# Altium schematic sheet Servo Controller Board.SchDoc
size A3; SheetNumber: 1; SheetTotal: 1
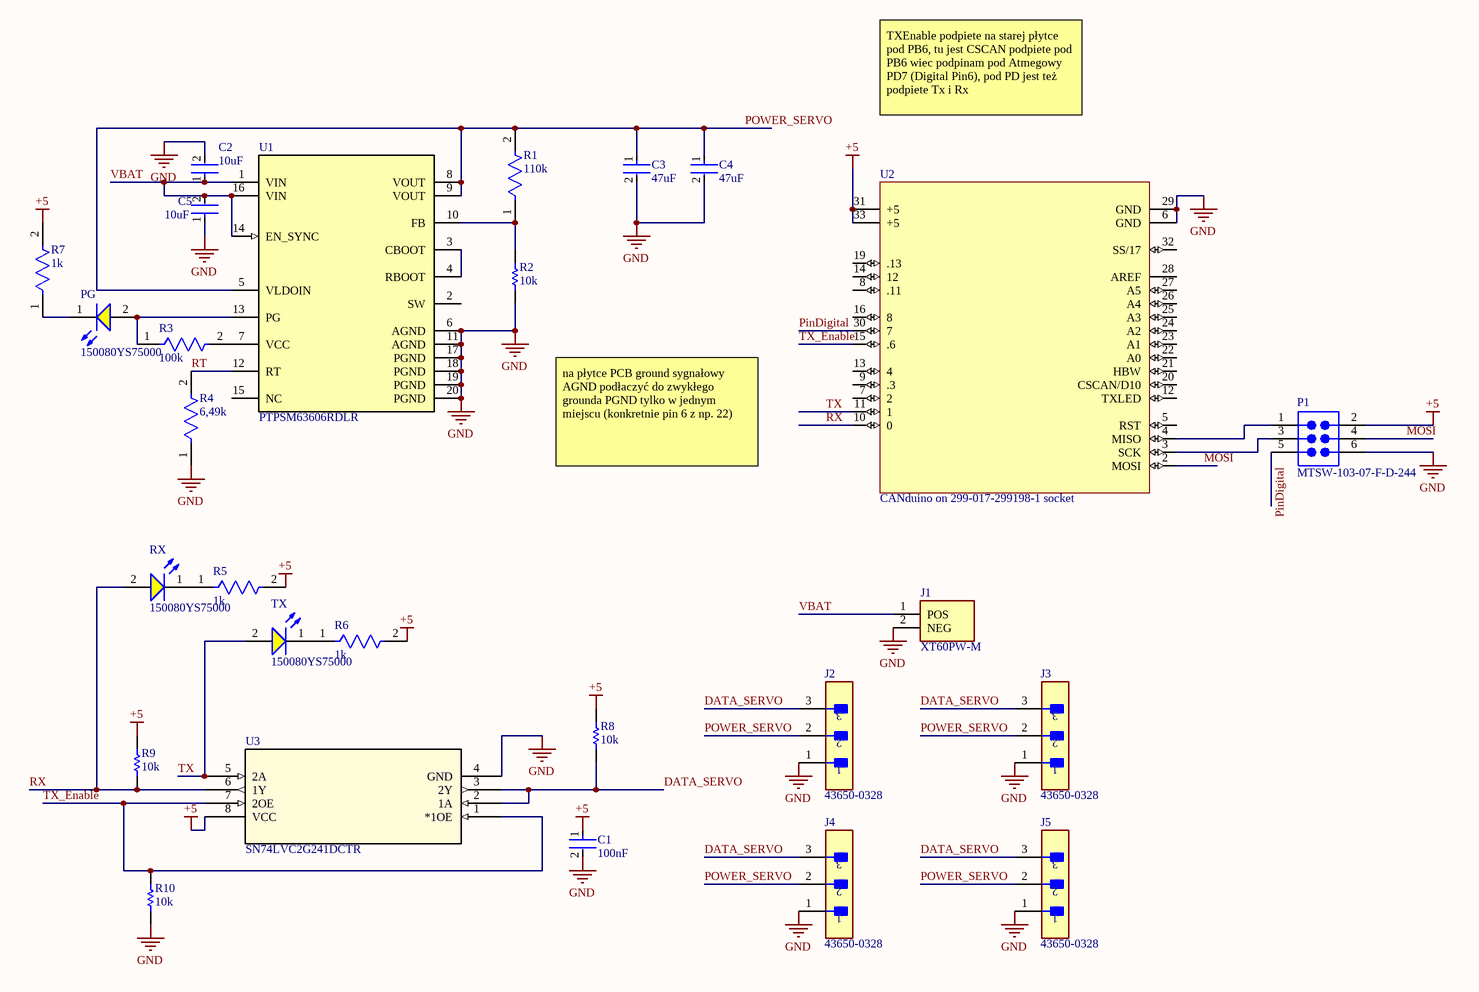
[diagram p0: Servo Controller Board.SchDoc]

## Parts
C1  100nF  [FP-0805-L_2_01_0_2-W_1_25-IPC_B]
C2  10uF  [FP-CL32-IPC_A]
C3  47uF  [FP-GRM32E-0_3-0_2-IPC_A]
C4  47uF  [FP-GRM32E-0_3-0_2-IPC_A]
C5  10uF  [FP-CL32-IPC_A]
J1  XT60PW-M  [AMASS_XT60PW-M]
J2  43650-0328  [FP-43650-0328-MFG]
J3  43650-0328  [FP-43650-0328-MFG]
J4  43650-0328  [FP-43650-0328-MFG]
J5  43650-0328  [FP-43650-0328-MFG]
P1  MTSW-103-07-F-D-244  [SMTC-MTSW-103-07-X-D-244]
PG  150080YS75000  [WL-SMCW_0805_150080xx75000]
R1  110k  [FP-AC0603-IPC_B]
R2  10k  [RESC1608X55X25NL10T15]
R3  100k  [FP-AC0603-IPC_B]
R4  6,49k  [FP-CRCW0603-e3-IPC_B]
R5  1k  [FP-RC0603-0_55-IPC_B]
R6  1k  [FP-RC0603-0_55-IPC_B]
R7  1k  [FP-RC0603-0_55-IPC_B]
R8  10k  [RESC1608X55X25NL10T15]
R9  10k  [RESC1608X55X25NL10T15]
R10  10k  [RESC1608X55X25NL10T15]
RX  150080YS75000  [WL-SMCW_0805_150080xx75000]
TX  150080YS75000  [WL-SMCW_0805_150080xx75000]
U1  PTPSM63606RDLR  [RDL0020A-MFG]
U2  CANduino on 299-017-299198-1 socket  [CANduino on 299-017-299198-1 socket]
U3  SN74LVC2G241DCTR  [DCT8]

## Nets
+5: C1.1 P1.2 R5.2 R6.2 R7.2 R8.2 R9.2 U2.31(+5) U2.33(+5) U3.8(VCC)
GND: C1.2 C2.2 C3.2 C4.2 C5.1 J1.2(NEG) J2.1 J3.1 J4.1 J5.1 P1.6 R2.1 R4.1 R10.1 U1.6(AGND) U1.11(AGND) U1.17(PGND) U1.18(PGND) U1.19(PGND) U1.20(PGND) U2.6(GND) U2.29(GND) U3.4(GND)
DATA_SERVO: J2.3 J3.3 J4.3 J5.3 R8.1 U3.2(1A) U3.3(2Y)
MOSI: P1.4 U2.2(MOSI)
PinDigital: P1.5 U2.30(7)
POWER_SERVO: C3.1 C4.1 J2.2 J3.2 J4.2 J5.2 R1.2 U1.5(VLDOIN) U1.8(VOUT) U1.9(VOUT)
RT: R4.2 U1.12(RT)
RX: R9.1 RX.2(A) U2.10(0) U3.6(1Y)
TX: TX.2(A) U2.11(1) U3.5(2A)
TX_Enable: R10.2 U2.15(.6) U3.1(*1OE) U3.7(2OE)
VBAT: C2.1 C5.2 J1.1(POS) U1.1(VIN) U1.14(EN_SYNC) U1.16(VIN)
NetP1_1: P1.1 U2.4(MISO)
NetP1_3: P1.3 U2.3(SCK)
NetPG_1: PG.1(K) R7.1
NetPG_2: PG.2(A) R3.1 U1.13(PG)
NetR1_1: R1.1 R2.2 U1.10(FB)
NetR3_2: R3.2 U1.7(VCC)
NetR5_1: R5.1 RX.1(K)
NetR6_1: R6.1 TX.1(K)
NetU1_3: U1.3(CBOOT) U1.4(RBOOT)

Not connected (* = marked no-connect by the designer): U1 2(SW) 15(NC); U2 5(RST) 7(2) 8(.11) 9(.3) 12(TXLED) 13(4) 14(12) 16(8) 19(.13) 20(CSCAN/D10) 21(HBW) 22(A0) 23(A1) 24(A2) 25(A3) 26(A4) 27(A5) 28(AREF) 32(SS/17)

## Notes on the sheet
- TXEnable podpiete na starej płytce pod PB6, tu jest CSCAN podpiete pod PB6 wiec podpinam pod Atmegowy PD7 (Digital Pin6), pod PD jest też podpiete Tx i Rx
- na płytce PCB ground sygnałowy AGND podłaczyć do zwykłego grounda PGND tylko w jednym miejscu (konkretnie pin 6 z np. 22)

## Library data of the parts
C1 = CMP-2007-04172-2: Automotive Ceramic Capacitor, 0805, 100nF, 10%, X7R, 15%, 100V; Voltage Rating (DC): 100V; Case Code (Metric): 2012; Mount: Surface Mount; Length: 2.01mm; Depth: 1.25mm; Lead Free: Lead Free; Ratings: AEC-Q200; Max Operating Temperature: 125°C; Tolerance: 10%; Case/Package: 0805; Width: 0.049inch; Package Quantity: 1; Thickness: 0.055inch; Construction: Flat; Min Operating Temperature: -55°C; REACH SVHC: No SVHC; Number of Pins: 2; Radiation Hardening: No; Capacitance: 100nF; Voltage Rating: 100V; Height: 1.4mm; Series: -; Voltage: 100V; Dielectric: X7R; Termination: SMD/SMT; Case Code (Imperial): 0805; RoHS Compliant: Yes; Packaging: Tape and Reel; Dielectric Material: Ceramic
C2 C5 = CMP-13271-002443-1: Cap Ceramic 10uF 35V X7R ±10% SMD 1210 +125°C Embossed T/R; Mount: Surface Mount; Case Code (Metric): 3225; Max Operating Temperature: 125°C; Length: 3.2mm; Voltage: 35V; Height: 1.8mm; Dielectric: X7R; Capacitance: 10uF; Package Quantity: 1; Width: 0.098inch; Tolerance: 10%; Packaging: Tape and Reel; Material: Ceramic; Case Code (Imperial): 1210; Min Operating Temperature: -55°C; Radiation Hardening: No; Thickness: 0.079inch; Depth: 2.5mm; Case/Package: 1210; Lead Free: Lead Free; Voltage Rating: 35V
C3 C4 = CMP-06035-000110-2: Chip Multilayer Ceramic Capacitors for General Purpose, 1210, 47uF, X6S, 22%, 10%, 16V; Case Code (Metric): 3225; Packaging: Tape and Reel; Mount: Surface Mount; Material: Ceramic; Voltage: 16V; Dielectric: X6S; Depth: 2.5mm; Min Operating Temperature: -55°C; Width: 2.5mm; Height: 2.5mm; Voltage Rating: 16V; Weight: 0.00388oz; Case Code (Imperial): 1210; Max Operating Temperature: 105°C; Capacitance: 47uF; Package Quantity: 1000; Case/Package: 1210; Voltage Rating (DC): 16V; Termination: SMD/SMT; Length: 3.2mm; Thickness: 0.106inch; Tolerance: 10%; Lead Free: Lead Free; REACH SVHC: No SVHC
J1 = XT60PW-M: Socket, DC supply, male, PIN: 2; MF: AMASS; Check_prices: https://www.snapeda.com/parts/XT60PW-M/AMASS/view-part/?ref=eda; SnapEDA_Link: https://www.snapeda.com/parts/XT60PW-M/AMASS/view-part/?ref=snap; Price: None; Availability: Not in stock; Package: Package; MP: XT60PW-M; Value: *
J2-J5 = CMP-00257-07661218-1: 43650-0328 Connector Header HDR 3 POS 3mm Solder ST Thru-Hole 3 Terminal 1 Port Micro-Fit 3.0 Tray; Manufacturer Lifecycle Status: ACTIVE; Voltage Rating: 600V; Plating: Tin; Current Rating: 5A; Number of Contacts: 3; Glow Wire Compliant: Compliant; Number of Rows: 1; Max Operating Temperature: 125°C; Lifecycle Status: Production; Country of Origin: US; Pitch: 3mm; Housing Material: Thermoplastic; Halogen Free: Low Halogen; Number of Positions: 3; Orientation: Vertical; Schedule B: 8536694040; Termination: Through Hole; RoHS: Compliant; Radiation Hardening: No; Number of Circuits: 3; Mount: Through Hole; Contact Plating: Gold; Contact Material: Brass, Gold, Nickel; Height: 10.15mm; NexarPartId: 7661218; Min Operating Temperature: -40°C
P1 = CMP-1024-00098-1: Modified .025" SQ Post Header, Through-hole, Vertical, -55 to 125 degC, 2.54 mm Pitch, 6-Pin, Male, RoHS; Manufacturer: Samtec; Pitch: 2.54 mm; DatasheetVersion: F-214; Orientation: Vertical; PackageDescription: Assembly .025" [.64] SQ Post Terminal Strip; ComponentLink1Description: Manufacturer URL; ComponentLink3Description: Package Specification; PackageVersion: BI, 2/1987; ComponentLink1URL: http://www.samtec.com; PackageReference: MTSW-103-07-X-D-244; ComponentLink3URL: http://www.samtec.com/documents/webfiles/cpdf/MTSW-XXX-XX-X-X-XXXX-XX-XXX-MKT1.pdf; Temperature Range: -55 to 125 degC; Mounting Technology: Through-hole; PartNumber: MTSW-103-07-F-D-244; RoHS: True; ComponentLink2URL: http://www.samtec.com/documents/webfiles/pdf/MTSW.PDF; ComponentLink2Description: Datasheet
PG RX TX = CMP-1426-00012-3: 2 V Yellow LED 2012 (0805) SMD, Wurth Elektronik WL-SMCW 150080YS75000; Dominant Wavelength: 590nm; Viewing Angle: 140°; Power Dissipation: 72mW; Peak Wavelength: 595nm; Lens Style: Clear, Rectangular; Max Junction Temperature (Tj): 95°C; Forward Voltage: 2V; Forward Current: 100mA; Luminous Intensity: 120mcd; Reverse Voltage: 5V; Test Current: 20mA; Case Code (Imperial): 0805; Color: Yellow; Width: 1.25mm; RoHS: Compliant; Min Operating Temperature: -40°C; Height: 700µm; Wavelength: 590nm; Length: 2mm; Case Code (Metric): 2012; Packaging: Tape and Reel; Mount: Surface Mount; REACH SVHC: Unknown; Case/Package: 0805; Max Operating Temperature: 85°C; Max Reverse Voltage (DC): 5V
R1 = CMP-03412-026184-2: RES 110KΩ 1.00% 0.1W 0603; Tolerance: 1%; Power Rating: 100mW; Resistance: 110kR; Voltage Rating: 50V; Temperature Coefficient: 100ppm/°C; Termination: SMD/SMT; Features: Moisture Resistant; Packaging: Tape and Reel; Max Operating Temperature: 155°C; Number of Terminations: 2; Max Power Dissipation: 100mW; Width: 0.8mm; Case/Package: 0603; Height: 0.022inch; Min Operating Temperature: -55°C; RoHS Compliant: Yes; Length: 0.063inch; Resistor Type: Thick Film; Series: AC; Case Code (Imperial): 0603; Case Code (Metric): 1608
R2 R8-R10 = CMP-2000-05022-1: Resistor, 10 KOhm, +/- 5%, 100 mW, -55 to 155 degC, 0603 (1608 Metric), RoHS, Tape and Reel; Manufacturer: Yageo; Resistance: 10kOhms; Voltage Rating: 50V; Temperature Coefficient: 100PPM/C; Power Rating: 100mW; Package Reference: 603; Series: RC; Case Code - mm: 1608; Packaging: Reel; Datasheet URL: http://www.farnell.com/datasheets/443971.pdf; Datasheet Version: Rev. 4, 04/2009; Operating Temperature Range: -55Cto+155C; Product: ThickFilmResistorsGeneralPurpose; Package Description: 2-Pin Surface Mount Device, Body 1.6 x 0.8 mm; Manufacturer URL: http://www.yageo.com/; Case Code - in: 0603; Tolerance: 5%; Termination Style: SMD/SMT
R3 = CMP-2000-04816-3: RES 100KΩ 1.00% 0.1W 0603; Temperature Coefficient: 100ppm/°C; Voltage Rating: 50V; Max Power Dissipation: 100mW; Tolerance: 1%; Working Voltage: 75V; Resistance: 100kR; Min Operating Temperature: -55°C; Case Code (Imperial): 0603; Width: 0.031inch; Max Operating Temperature: 155°C; Military Standard: Not; Technology: THICK FILM; Ratings: AEC-Q200; Features: Moisture Resistant; Construction: Rectangular; Resistor Type: Thick Film; RoHS Compliant: Yes; Case Code (Metric): 1608; Termination: SMD/SMT; Series: AC; Lead Free: Lead Free; Length: 1.6mm; Depth: 0.8mm; Height: 0.022inch; Power Rating: 100mW; Package Quantity: 1; Packaging: Tape and Reel; Case/Package: 0603; Number of Terminations: 2; Moisture Sensitivity Level: 1
R4 = CMP-2000-03548-2: RES Thick Film, 6.49kΩ, 1%, 0.1W, 100ppm/°C, 0603; Max Power Dissipation: 100mW; Voltage Rating: 75V; Resistance: 6.49kR; Package Quantity: 10; Depth: 0.85mm; Case Code (Imperial): 0603; Number of Terminations: 2; Height: 0.45mm; Width: 0.033inch; Max Operating Temperature: 155°C; Temperature Coefficient: 100ppm/°C; Termination: SMD/SMT; Case/Package: 0603; Number of Pins: 2; Military Standard: Not; Power Rating: 100mW; Length: 1.55mm; Tolerance: 1%; Min Operating Temperature: -55°C; Contact Plating: Tin; Composition: Thick Film; Weight: 7.1E-05oz; Features: Automotive AEC-Q200; Packaging: Tape and Reel; Case Code (Metric): 1608; Radiation Hardening: No
R5-R7 = CMP-1659-00009-5: RES 1K OHM 1% 1/10W 0603; Resistance: 1kR; Voltage Rating: 50V; Power Rating: 100mW; Temperature Coefficient: 100ppm/°C; Military Standard: Not; REACH SVHC: No SVHC; Size Code: 0603; Features: Moisture Resistant; Number of Terminations: 2; Technology: THICK FILM; Series: RC; Case Code (Metric): 1608; Resistance Tolerance: 1%; Resistor Type: Thick Film; Termination: SMD/SMT; Contact Plating: Tin; Radiation Hardening: No; Min Operating Temperature: -55°C; Max Operating Temperature: 155°C; Packaging: Tape and Reel; Max Power Dissipation: 100mW; RoHS Compliant: Yes; Height: 0.45mm; Lead Free: Lead Free; Case/Package: 0603; Length: 1.6mm; Tolerance: 1%; Case Code (Imperial): 0603; Construction: Rectangular; Depth: 0.8mm
U1 = PTPSM63606RDLR: No Description Available; Mfr_Name: Texas Instruments; TYPE: TYPE; RefDes: RefDes
U2 = CANduino on 299-017-299198-1 socket: CANduino board without pins 1, 17, 18 and 34 due to socket specification
U3 = SN74LVC2G241DCTR: No Description Available; Mfr_Name: Texas Instruments; RefDes: RefDes; Type: Type